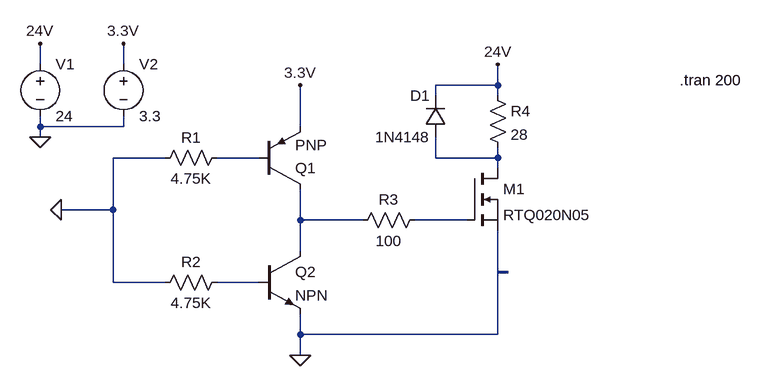
[diagram p0: schematic cbpi_out.asc]
cbpi_out.asc, the LTspice schematic file:
Version 4
SHEET 1 1056 680
WIRE -96 80 -96 48
WIRE 32 80 32 48
WIRE 608 112 608 80
WIRE 608 112 512 112
WIRE 512 128 512 112
WIRE 608 128 608 112
WIRE -96 176 -96 160
WIRE 32 176 32 160
WIRE 32 176 -96 176
WIRE 304 176 304 112
WIRE -96 192 -96 176
WIRE 96 224 16 224
WIRE 240 224 176 224
WIRE 512 224 512 192
WIRE 608 224 608 208
WIRE 608 224 512 224
WIRE 608 240 608 224
WIRE 16 304 16 224
WIRE 16 304 -64 304
WIRE 304 320 304 272
WIRE 400 320 304 320
WIRE 560 320 480 320
WIRE 304 368 304 320
WIRE 608 400 608 336
WIRE 16 416 16 304
WIRE 96 416 16 416
WIRE 240 416 176 416
WIRE 304 496 304 464
WIRE 608 496 608 400
WIRE 608 496 304 496
WIRE 304 528 304 496
FLAG 304 528 0
FLAG 608 80 24V
FLAG -96 192 0
FLAG -96 48 24V
FLAG 32 48 3.3V
FLAG 304 112 3.3V
FLAG -64 304 0
BUSTAP 608 400 624 400
SYMBOL pnp 240 272 M180
SYMATTR InstName Q1
SYMBOL npn 240 368 R0
SYMATTR InstName Q2
SYMBOL res 192 208 R90
WINDOW 0 0 56 VBottom 2
WINDOW 3 32 56 VTop 2
SYMATTR InstName R1
SYMATTR Value 4.75K
SYMBOL res 192 400 R90
WINDOW 0 0 56 VBottom 2
WINDOW 3 32 56 VTop 2
SYMATTR InstName R2
SYMATTR Value 4.75K
SYMBOL res 496 304 R90
WINDOW 0 0 56 VBottom 2
WINDOW 3 32 56 VTop 2
SYMATTR InstName R3
SYMATTR Value 100
SYMBOL nmos 560 240 R0
SYMATTR InstName M1
SYMATTR Value RTQ020N05
SYMBOL diode 528 192 R180
WINDOW 0 24 64 Left 2
WINDOW 3 24 0 Left 2
SYMATTR InstName D1
SYMATTR Value 1N4148
SYMBOL voltage -96 64 R0
SYMATTR InstName V1
SYMATTR Value 24
SYMATTR SpiceLine Rser=0
SYMBOL voltage 32 64 R0
SYMATTR InstName V2
SYMATTR Value 3.3
SYMATTR SpiceLine Rser=0
SYMBOL res 592 112 R0
SYMATTR InstName R4
SYMATTR Value 28
TEXT 888 104 Left 2 !.tran 200

The netlist it stands for:
* cbpi_out.asc
Q1 N003 N001 3.3V 0 PNP
Q2 N003 N005 0 0 NPN
R1 N001 0 4.75K
R2 N005 0 4.75K
R3 N004 N003 100
M1 N002 N004 0 0 RTQ020N05
D1 N002 24V 1N4148
V1 24V 0 24 Rser=0
V2 3.3V 0 3.3 Rser=0
R4 24V N002 28
.model D D
.lib standard.dio
.model NPN NPN
.model PNP PNP
.lib standard.bjt
.model NMOS NMOS
.model PMOS PMOS
.lib standard.mos
.tran 200
.backanno
.end